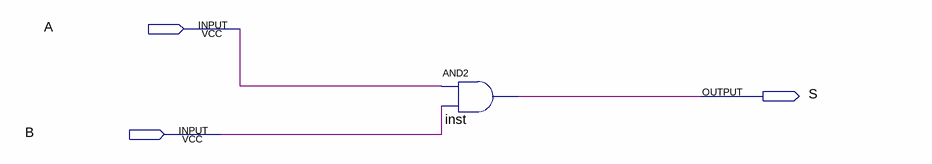
[diagram p0: schematic sheet]
// Quartus schematic port_et.bdf as structural Verilog: 1 symbols, 3 pins
module port_et (
  input  A,
  input  B,
  output S
);

  and inst (S, A, B);
endmodule
